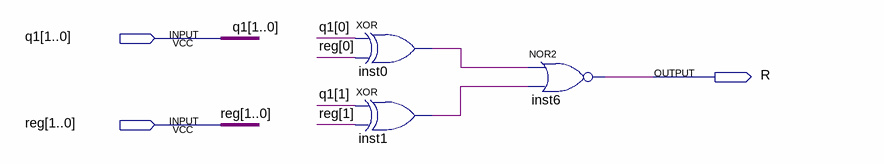
[diagram p0: schematic sheet]
// Quartus schematic Comparing-Sheme.bdf as structural Verilog: 3 symbols, 3 pins
module \Comparing-Sheme  (
  input  [1:0] q1,
  input  [1:0] \reg ,
  output R
);

  wire inst0_out, inst1_out;

  xor inst0 (inst0_out, q1[0], \reg [0]);
  xor inst1 (inst1_out, q1[1], \reg [1]);
  nor inst6 (R, inst0_out, inst1_out);
endmodule
